# Altium project 3DMouse.PrjPcb
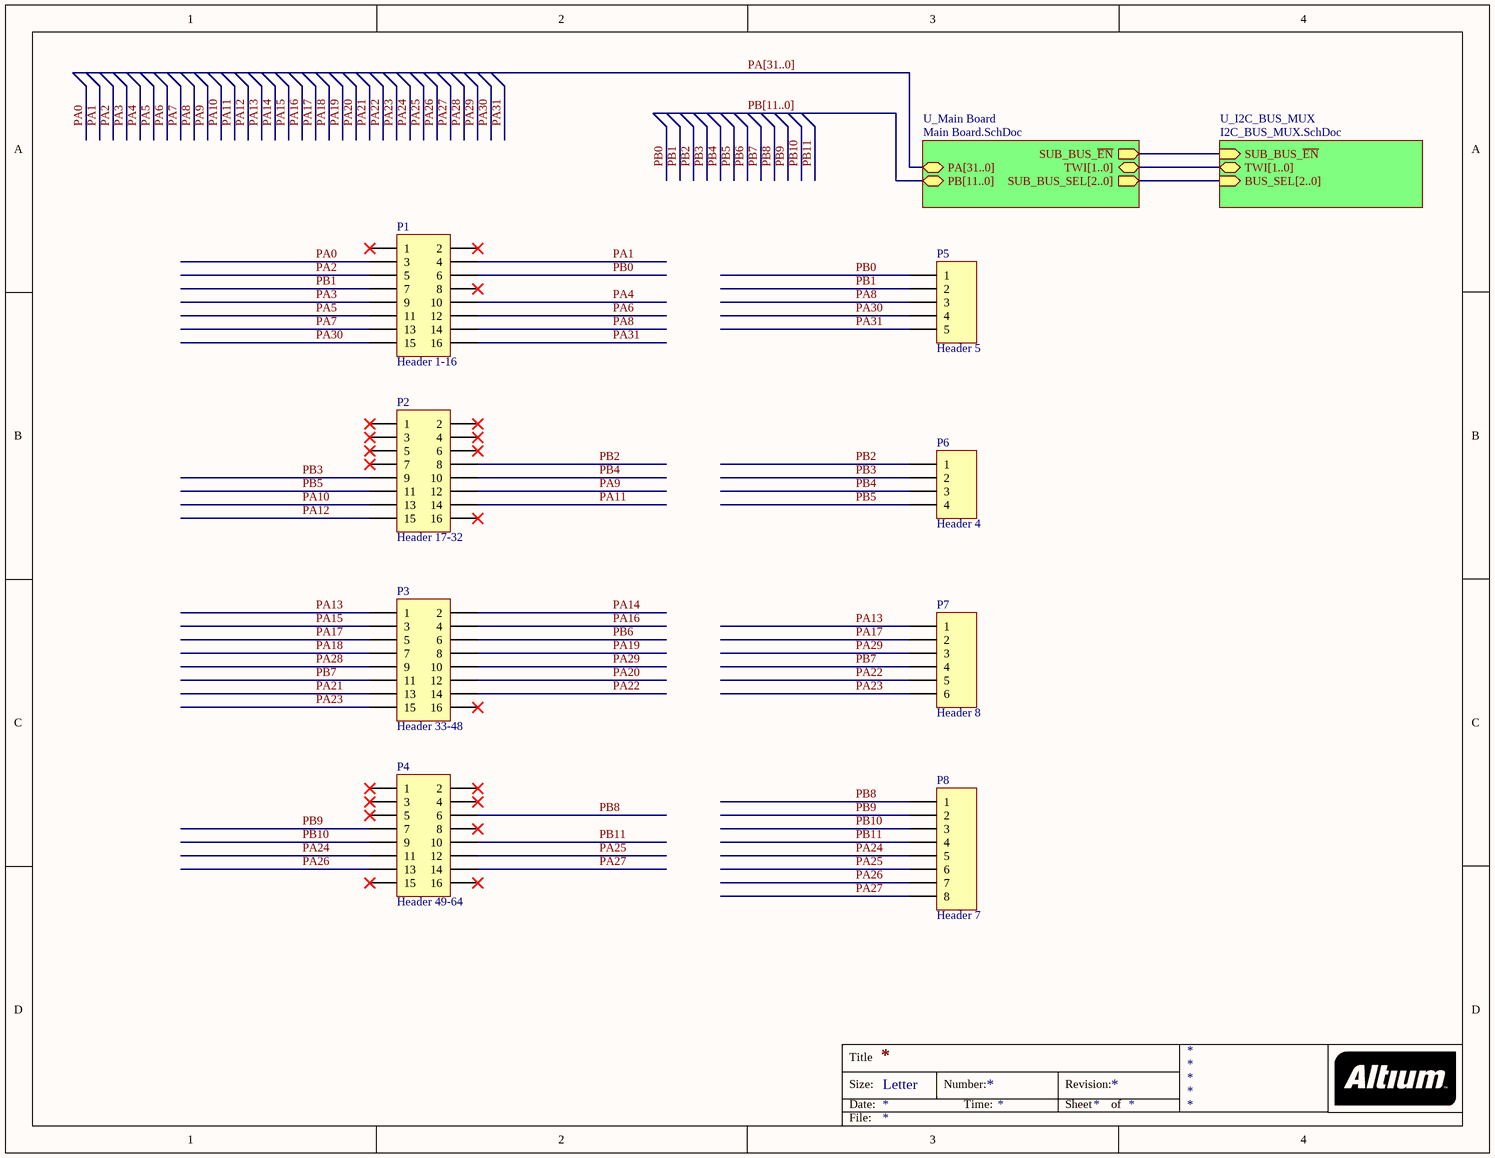
[diagram p0: 3DMouseMainBoardAssembly.SchDoc]
4 sheets, 64 parts. Net scope: hierarchical (ports join the sheet entries above them; power ports are global).
Board files: Main Board v5 China_Commercial.PcbDoc, Main Board ECEshop.PcbDoc, PCB1.PcbDoc, Main Board.PcbDoc
Sheets:
  3DMouseMainBoardAssembly.SchDoc
    U_I2C_BUS_MUX = I2C_BUS_MUX.SchDoc
    U_Main Board = Main Board.SchDoc
      U_3 = 3.3V Power Supply.SchDoc

## Sheet 3DMouseMainBoardAssembly.SchDoc
size Letter

### Parts
P1  Header 1-16  [HDR2X8]
P2  Header 17-32  [HDR2X8]
P3  Header 33-48  [HDR2X8]
P4  Header 49-64  [HDR2X8]
P5  Header 5  [HDR1X5]
P6  Header 4  [HDR1X4]
P7  Header 8  [HDR1X6]
P8  Header 7  [HDR1X8]

### Sub-sheets
U_I2C_BUS_MUX = I2C_BUS_MUX.SchDoc: SUB_BUS_~{EN} (in), TWI[1..0] (bidir), BUS_SEL[2..0] (in)
U_Main Board = Main Board.SchDoc: TWI[1..0] (bidir), SUB_BUS_~{EN} (out), SUB_BUS_SEL[2..0] (out), PA[31..0] (bidir), PB[11..0] (bidir)

### Nets
PA0: P1.3  [project net JTAG_TDI]
PA1: P1.4  [project net JTAG_TDO]
PA2: P1.5  [project net JTAG_TMS]
PA3: P1.9
PA4: P1.10 ; sheet U_I2C_BUS_MUX/SUB_BUS_~{EN}, sheet U_Main Board/SUB_BUS_~{EN}
PA5: P1.11  [project net BUS_SEL0]
PA6: P1.12  [project net BUS_SEL1]
PA7: P1.13  [project net BUS_SEL2]
PA8: P1.14 P5.3  [project net GPIO8]
PA9: P2.12
PA10: P2.13
PA11: P2.14
PA12: P2.15
PA13: P3.1 P7.1  [project net GPIO13]
PA14: P3.2  [project net MOSI]
PA15: P3.3
PA16: P3.4  [project net CSN]
PA17: P3.5 P7.2  [project net GPIO17]
PA18: P3.7
PA19: P3.8
PA20: P3.12
PA21: P3.13
PA22: P3.14 P7.5  [project net GPIO22]
PA23: P3.15 P7.6  [project net GPIO23]
PA24: P4.11 P8.5  [project net GPIO24]
PA25: P4.12 P8.6
PA26: P4.13 P8.7  [project net GPIO26]
PA27: P4.14 P8.8  [project net GPIO27]
PA28: P3.9  [project net MISO]
PA29: P3.10 P7.3  [project net GPIO29]
PA30: P1.15 P5.4  [project net GPIO30]
PA31: P1.16 P5.5  [project net GPIO31]
PB0: P1.6 P5.1  [project net GPIO32]
PB1: P1.7 P5.2  [project net GPIO33]
PB2: P2.8 P6.1  [project net GPIO34]
PB3: P2.9 P6.2  [project net GPIO35]
PB4: P2.10 P6.3  [project net GPIO36]
PB5: P2.11 P6.4  [project net GPIO37]
PB6: P3.6  [project net CE]
PB7: P3.11 P7.4  [project net GPIO39]
PB8: P4.6 P8.1  [project net GPIO40]
PB9: P4.7 P8.2  [project net GPIO41]
PB10: P4.9 P8.3  [project net GPIO42]
PB11: P4.10 P8.4  [project net GPIO43]

Not connected (* = marked no-connect by the designer): P1 1* 2* 8*; P2 1* 2* 3* 4* 5* 6* 7* 16*; P3 16*; P4 1* 2* 3* 4* 5* 8* 15* 16*

### Buses and harness runs
bus PA[31..0] = sheet U_Main Board/PA[31..0]
bus PB[11..0] = sheet U_Main Board/PB[11..0]
bus sheet U_I2C_BUS_MUX/BUS_SEL[2..0] = sheet U_Main Board/SUB_BUS_SEL[2..0]
bus sheet U_I2C_BUS_MUX/TWI[1..0] = sheet U_Main Board/TWI[1..0]

### Notes on the sheet
- Title
- Size:
- Date:
- Letter
- Number:
- Time:
- Revision:
- Sheet
- of
- File:

### Library data of the parts
P1-P4 = Header 8X2: Header, 8-Pin, Dual row; LatestRevisionDate: 17-Jul-2002; LatestRevisionNote: Re-released for DXP Platform.; Publisher: Altium Limited
P5 = Header 5: Header, 5-Pin; LatestRevisionDate: 17-Jul-2002; LatestRevisionNote: Re-released for DXP Platform.; Publisher: Altium Limited
P6 = Header 4: Header, 4-Pin; LatestRevisionDate: 17-Jul-2002; LatestRevisionNote: Re-released for DXP Platform.; Publisher: Altium Limited
P7 = Header 6: Header, 6-Pin; LatestRevisionDate: 17-Jul-2002; LatestRevisionNote: Re-released for DXP Platform.; Publisher: Altium Limited
P8 = Header 8: Header, 8-Pin; LatestRevisionDate: 17-Jul-2002; LatestRevisionNote: Re-released for DXP Platform.; Publisher: Altium Limited

## Sheet I2C_BUS_MUX.SchDoc
size Letter
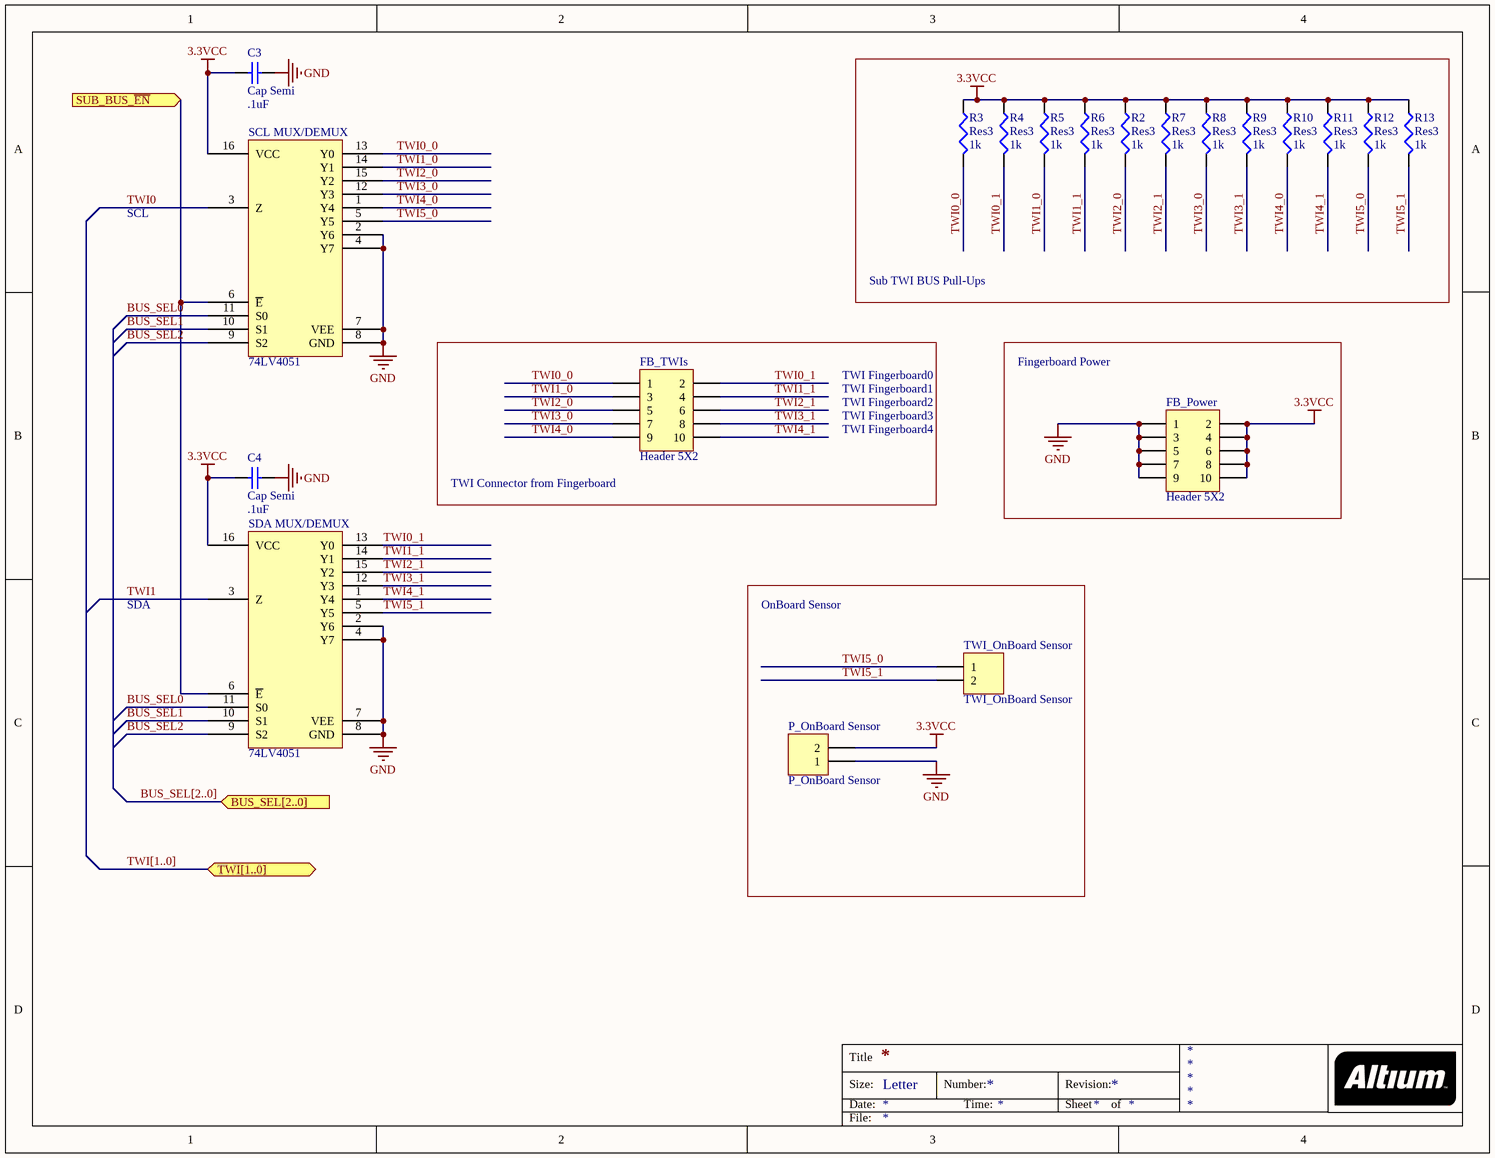
[diagram p1: I2C_BUS_MUX.SchDoc]

### Parts
C3  Cap Semi  value .1uF  [CAPC2012N]
C4  Cap Semi  value .1uF  [CAPC2012N]
FB_Power  Header 5X2  [HDR2X5]
FB_TWIs  Header 5X2  [HDR2X5]
P_OnBoard_Sensor  P_OnBoard Sensor  [HDR1X2]
R2  Res3  value 1k  [RESC2012N]
R3  Res3  value 1k  [RESC2012N]
R4  Res3  value 1k  [RESC2012N]
R5  Res3  value 1k  [RESC2012N]
R6  Res3  value 1k  [RESC2012N]
R7  Res3  value 1k  [RESC2012N]
R8  Res3  value 1k  [RESC2012N]
R9  Res3  value 1k  [RESC2012N]
R10  Res3  value 1k  [RESC2012N]
R11  Res3  value 1k  [RESC2012N]
R12  Res3  value 1k  [RESC2012N]
R13  Res3  value 1k  [RESC2012N]
SCL_MUX/DEMUX  74LV4051  [SOIC127P600-16N]
SDA_MUX/DEMUX  74LV4051  [SOIC127P600-16N]
TWI_OnBoard_Sensor  TWI_OnBoard Sensor  [HDR1X2]

### Blocks framed on the sheet
Sub TWI BUS Pull-Ups: R2-R13
Fingerboard Power: FB_Power
OnBoard Sensor: P_OnBoard_Sensor TWI_OnBoard_Sensor

### Ports
BUS_SEL[2..0] (in), SUB_BUS_~{EN} (in), TWI[1..0] (bidir)

### Nets
3.3VCC: C3.2 C4.2 FB_Power.2 FB_Power.4 FB_Power.6 FB_Power.8 FB_Power.10 P_OnBoard_Sensor.2 R2.1 R3.1 R4.1 R5.1 R6.1 R7.1 R8.1 R9.1 R10.1 R11.1 R12.1 R13.1 SCL_MUX/DEMUX.16(VCC) SDA_MUX/DEMUX.16(VCC)
GND: C3.1 C4.1 FB_Power.1 FB_Power.3 FB_Power.5 FB_Power.7 FB_Power.9 P_OnBoard_Sensor.1 SCL_MUX/DEMUX.2(Y6) SCL_MUX/DEMUX.4(Y7) SCL_MUX/DEMUX.7(VEE) SCL_MUX/DEMUX.8(GND) SDA_MUX/DEMUX.2(Y6) SDA_MUX/DEMUX.4(Y7) SDA_MUX/DEMUX.7(VEE) SDA_MUX/DEMUX.8(GND)
BUS_SEL0: SCL_MUX/DEMUX.11(S0) SDA_MUX/DEMUX.11(S0)
BUS_SEL1: SCL_MUX/DEMUX.10(S1) SDA_MUX/DEMUX.10(S1)
BUS_SEL2: SCL_MUX/DEMUX.9(S2) SDA_MUX/DEMUX.9(S2)
PA4: SCL_MUX/DEMUX.6(~{E}) SDA_MUX/DEMUX.6(~{E}) ; port SUB_BUS_~{EN}
TWI0: SCL_MUX/DEMUX.3(Z)  [project net PA9]
TWI0_0: FB_TWIs.1 R3.2 SCL_MUX/DEMUX.13(Y0)
TWI0_1: FB_TWIs.2 R4.2 SDA_MUX/DEMUX.13(Y0)
TWI1: SDA_MUX/DEMUX.3(Z)  [project net PA10]
TWI1_0: FB_TWIs.3 R5.2 SCL_MUX/DEMUX.14(Y1)
TWI1_1: FB_TWIs.4 R6.2 SDA_MUX/DEMUX.14(Y1)
TWI2_0: FB_TWIs.5 R2.2 SCL_MUX/DEMUX.15(Y2)
TWI2_1: FB_TWIs.6 R7.2 SDA_MUX/DEMUX.15(Y2)
TWI3_0: FB_TWIs.7 R8.2 SCL_MUX/DEMUX.12(Y3)
TWI3_1: FB_TWIs.8 R9.2 SDA_MUX/DEMUX.12(Y3)
TWI4_0: FB_TWIs.9 R10.2 SCL_MUX/DEMUX.1(Y4)
TWI4_1: FB_TWIs.10 R11.2 SDA_MUX/DEMUX.1(Y4)
TWI5_0: R12.2 SCL_MUX/DEMUX.5(Y5) TWI_OnBoard_Sensor.1
TWI5_1: R13.2 SDA_MUX/DEMUX.5(Y5) TWI_OnBoard_Sensor.2

### Buses and harness runs
bus BUS_SEL[2..0] = port BUS_SEL[2..0]
bus TWI[1..0] = port TWI[1..0]

### Notes on the sheet
- SCL
- TWI Fingerboard0
- TWI Fingerboard1
- TWI Fingerboard2
- TWI Fingerboard3
- TWI Fingerboard4
- (near FB_TWIs) TWI Connector from Fingerboard
- SDA
- Title
- Size:
- Date:
- Letter
- Number:
- Time:
- Revision:
- Sheet
- of
- File:

### Library data of the parts
C3 C4 = Cap Semi: Capacitor (Semiconductor SIM Model); Published: 8-Jun-2000; LatestRevisionDate: 29-May-2009; LatestRevisionNote: IPC-7351 Footprint Added.; PackageReference: C1206; Publisher: Altium Limited; PackageDescription: Chip Capacitor
FB_Power FB_TWIs = Header 5X2: Header, 5-Pin, Dual row; LatestRevisionDate: 17-Jul-2002; LatestRevisionNote: Re-released for DXP Platform.; Publisher: Altium Limited
P_OnBoard_Sensor TWI_OnBoard_Sensor = Header 2: Header, 2-Pin; LatestRevisionDate: 17-Jul-2002; LatestRevisionNote: Re-released for DXP Platform.; Publisher: Altium Limited
R2-R13 = Res3: Resistor; Published: 8-Jun-2000; LatestRevisionDate: 29-May-2009; LatestRevisionNote: IPC-7351 Footprint Added.; PackageReference: J1-0603; Publisher: Altium Limited; PackageDescription: Chip Resistor

## Sheet Main Board.SchDoc: Main Board
size Letter
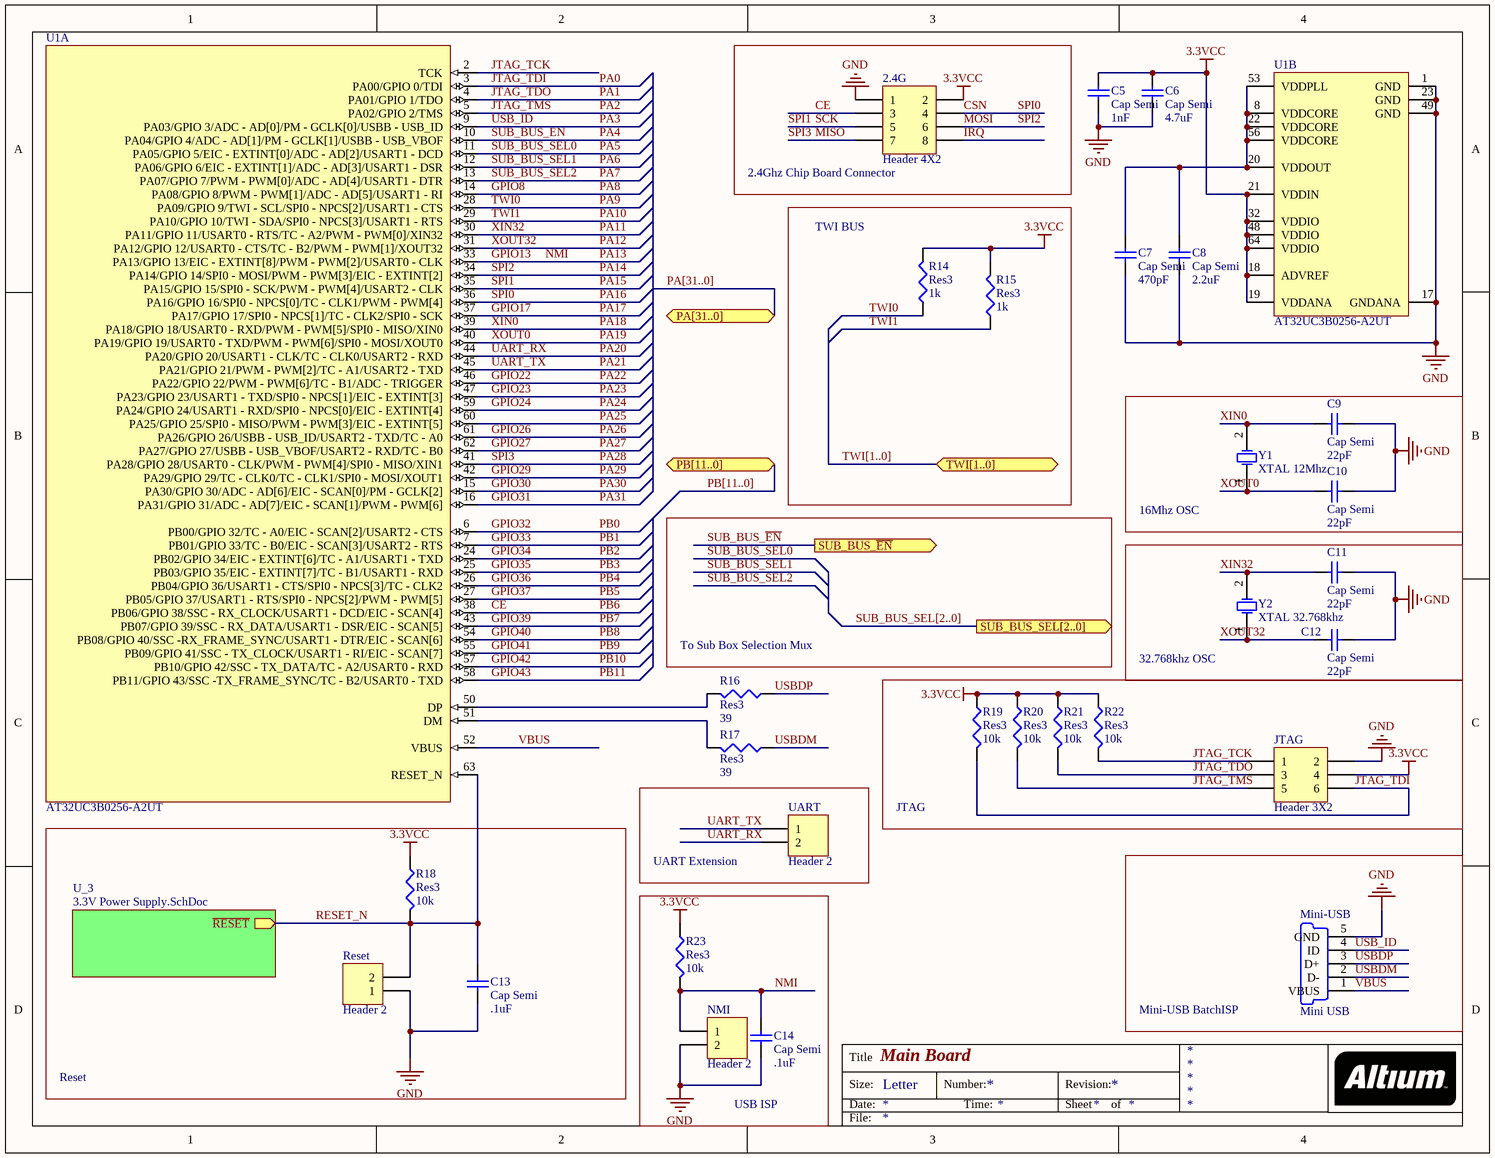
[diagram p2: Main Board.SchDoc]

### Parts
2.4G  Header 4X2  [HDR2X4]
C5  Cap Semi  value 1nF  [CAPC2012N]
C6  Cap Semi  value 4.7uF  [CAPC2012N]
C7  Cap Semi  value 470pF  [CAPC2012N]
C8  Cap Semi  value 2.2uF  [CAPC2012N]
C9  Cap Semi  value 22pF  [CAPC2012N]
C10  Cap Semi  value 22pF  [CAPC2012N]
C11  Cap Semi  value 22pF  [CAPC2012N]
C12  Cap Semi  value 22pF  [CAPC2012N]
C13  Cap Semi  value .1uF  [CAPC2012N]
C14  Cap Semi  value .1uF  [CAPC2012N]
JTAG  Header 3X2  [HDR2X3]
Mini-USB  Mini USB  [MINI USB]
NMI  Header 2  [HDR1X2]
R14  Res3  value 1k  [RESC2012N]
R15  Res3  value 1k  [RESC2012N]
R16  Res3  value 39  [RESC2012N]
R17  Res3  value 39  [RESC2012N]
R18  Res3  value 10k  [RESC2012N]
R19  Res3  value 10k  [RESC2012N]
R20  Res3  value 10k  [RESC2012N]
R21  Res3  value 10k  [RESC2012N]
R22  Res3  value 10k  [RESC2012N]
R23  Res3  value 10k  [RESC2012N]
Reset  Header 2  [HDR1X2]
U1  AT32UC3B0256-A2UT  [TQFP64_N - ECESHOP]  (parts A,B of 2)
UART  Header 2  [HDR1X2]
Y1  XTAL 12Mhz  [HC-49U - Through Hole]
Y2  XTAL 32.768khz  [XTAL32.768]

### Blocks framed on the sheet
2.4Ghz Chip Board Connector: 2.4G
TWI BUS: R14 R15
16Mhz OSC: C9 C10 Y1
32.768khz OSC: C11 C12 Y2
JTAG: JTAG R19-R22
UART Extension: UART
Reset: C13 R18 Reset
Mini-USB BatchISP: Mini-USB
USB ISP: C14 NMI R23

### Sub-sheets
U_3 = 3.3V Power Supply.SchDoc: ~{RESET} (out)

### Ports
PA[31..0] (bidir), PB[11..0] (bidir), SUB_BUS_SEL[2..0] (out), SUB_BUS_~{EN} (out), TWI[1..0] (bidir)

### Nets
3.3VCC: 2.4G.2 C5.2 C6.2 JTAG.4 R14.2 R15.2 R18.1 R19.1 R20.1 R21.1 R22.1 R23.1 U1.18(ADVREF) U1.19(VDDANA) U1.21(VDDIN) U1.32(VDDIO) U1.48(VDDIO) U1.64(VDDIO)
GND: 2.4G.1 C5.1 C6.1 C7.1 C8.1 C9.1 C10.1 C11.1 C12.1 C13.2 C14.2 JTAG.2 Mini-USB.5(GND) NMI.2 Reset.1 U1.1(GND) U1.17(GNDANA) U1.23(GND) U1.49(GND)
CE: 2.4G.3 U1.38(PB06/GPIO_38/SSC_-_RX_CLOCK/USART1_-_DCD/EIC_-_SCAN[4])  [also labelled PB6]
CSN: 2.4G.4 U1.36(PA16/GPIO_16/SPI0_-_NPCS[0]/TC_-_CLK1/PWM_-_PWM[4])  [also labelled PA16, SPI0]
GPIO8: U1.14(PA08/GPIO_8/PWM_-_PWM[1]/ADC_-_AD[5]/USART1_-_RI)  [also labelled PA8]
GPIO13: C14.1 NMI.1 R23.2 U1.33(PA13/GPIO_13/EIC_-_EXTINT[8]/PWM_-_PWM[2]/USART0_-_CLK)  [also labelled NMI, PA13]
GPIO17: U1.37(PA17/GPIO_17/SPI0_-_NPCS[1]/TC_-_CLK2/SPI0_-_SCK)  [also labelled PA17]
GPIO22: U1.46(PA22/GPIO_22/PWM_-_PWM[6]/TC_-_B1/ADC_-_TRIGGER)  [also labelled PA22]
GPIO23: U1.47(PA23/GPIO_23/USART1_-_TXD/SPI0_-_NPCS[1]/EIC_-_EXTINT[3])  [also labelled PA23]
GPIO24: U1.59(PA24/GPIO_24/USART1_-_RXD/SPI0_-_NPCS[0]/EIC_-_EXTINT[4])  [also labelled PA24]
GPIO26: U1.61(PA26/GPIO_26/USBB_-_USB_ID/USART2_-_TXD/TC_-_A0)  [also labelled PA26]
GPIO27: U1.62(PA27/GPIO_27/USBB_-_USB_VBOF/USART2_-_RXD/TC_-_B0)  [also labelled PA27]
GPIO29: U1.42(PA29/GPIO_29/TC_-_CLK0/TC_-_CLK1/SPI0_-_MOSI/XOUT1)  [also labelled PA29]
GPIO30: U1.15(PA30/GPIO_30/ADC_-_AD[6]/EIC_-_SCAN[0]/PM_-_GCLK[2])  [also labelled PA30]
GPIO31: U1.16(PA31/GPIO_31/ADC_-_AD[7]/EIC_-_SCAN[1]/PWM_-_PWM[6])  [also labelled PA31]
GPIO32: U1.6(PB00/GPIO_32/TC_-_A0/EIC_-_SCAN[2]/USART2_-_CTS)  [also labelled PB0]
GPIO33: U1.7(PB01/GPIO_33/TC_-_B0/EIC_-_SCAN[3]/USART2_-_RTS)  [also labelled PB1]
GPIO34: U1.24(PB02/GPIO_34/EIC_-_EXTINT[6]/TC_-_A1/USART1_-_TXD)  [also labelled PB2]
GPIO35: U1.25(PB03/GPIO_35/EIC_-_EXTINT[7]/TC_-_B1/USART1_-_RXD)  [also labelled PB3]
GPIO36: U1.26(PB04/GPIO_36/USART1_-_CTS/SPI0_-_NPCS[3]/TC_-_CLK2)  [also labelled PB4]
GPIO37: U1.27(PB05/GPIO_37/USART1_-_RTS/SPI0_-_NPCS[2]/PWM_-_PWM[5])  [also labelled PB5]
GPIO39: U1.43(PB07/GPIO_39/SSC_-_RX_DATA/USART1_-_DSR/EIC_-_SCAN[5])  [also labelled PB7]
GPIO40: U1.54(PB08/GPIO_40/SSC_-RX_FRAME_SYNC/USART1_-_DTR/EIC_-_SCAN[6])  [also labelled PB8]
GPIO41: U1.55(PB09/GPIO_41/SSC_-_TX_CLOCK/USART1_-_RI/EIC_-_SCAN[7])  [also labelled PB9]
GPIO42: U1.57(PB10/GPIO_42/SSC_-_TX_DATA/TC_-_A2/USART0_-_RXD)  [also labelled PB10]
GPIO43: U1.58(PB11/GPIO_43/SSC_-TX_FRAME_SYNC/TC_-_B2/USART0_-_TXD)  [also labelled PB11]
IRQ: 2.4G.8
JTAG_TCK: JTAG.1 R22.2 U1.2(TCK)
JTAG_TDI: JTAG.6 R19.2 U1.3(PA00/GPIO_0/TDI)  [also labelled PA0]
JTAG_TDO: JTAG.3 R21.2 U1.4(PA01/GPIO_1/TDO)  [also labelled PA1]
JTAG_TMS: JTAG.5 R20.2 U1.5(PA02/GPIO_2/TMS)  [also labelled PA2]
MISO: 2.4G.7 U1.41(PA28/GPIO_28/USART0_-_CLK/PWM_-_PWM[4]/SPI0_-_MISO/XIN1)  [also labelled PA28, SPI3]
MOSI: 2.4G.6 U1.34(PA14/GPIO_14/SPI0_-_MOSI/PWM_-_PWM[3]/EIC_-_EXTINT[2])  [also labelled PA14, SPI2]
PA3: Mini-USB.4(ID) U1.9(PA03/GPIO_3/ADC_-_AD[0]/PM_-_GCLK[0]/USBB_-_USB_ID)  [also labelled USB_ID]
PA4: U1.10(PA04/GPIO_4/ADC_-_AD[1]/PM_-_GCLK[1]/USBB_-_USB_VBOF) ; port SUB_BUS_~{EN}  [also labelled SUB_BUS_~{EN}]
PA5: U1.11(PA05/GPIO_5/EIC_-_EXTINT[0]/ADC_-_AD[2]/USART1_-_DCD)  [also labelled SUB_BUS_SEL0]  [project net BUS_SEL0]
PA6: U1.12(PA06/GPIO_6/EIC_-_EXTINT[1]/ADC_-_AD[3]/USART1_-_DSR)  [also labelled SUB_BUS_SEL1]  [project net BUS_SEL1]
PA7: U1.13(PA07/GPIO_7/PWM_-_PWM[0]/ADC_-_AD[4]/USART1_-_DTR)  [also labelled SUB_BUS_SEL2]  [project net BUS_SEL2]
PA9: R14.1 U1.28(PA09/GPIO_9/TWI_-_SCL/SPI0_-_NPCS[2]/USART1_-_CTS)  [also labelled TWI0]
PA10: R15.1 U1.29(PA10/GPIO_10/TWI_-_SDA/SPI0_-_NPCS[3]/USART1_-_RTS)  [also labelled TWI1]
PA11: C11.2 U1.30(PA11/GPIO_11/USART0_-_RTS/TC_-_A2/PWM_-_PWM[0]/XIN32) Y2.2(OSC2)  [also labelled XIN32]
PA12: C12.2 U1.31(PA12/GPIO_12/USART0_-_CTS/TC_-_B2/PWM_-_PWM[1]/XOUT32) Y2.1(OSC1)  [also labelled XOUT32]
PA15: 2.4G.5 U1.35(PA15/GPIO_15/SPI0_-_SCK/PWM_-_PWM[4]/USART2_-_CLK)  [also labelled SCK, SPI1]
PA18: C9.2 U1.39(PA18/GPIO_18/USART0_-_RXD/PWM_-_PWM[5]/SPI0_-_MISO/XIN0) Y1.2(OSC2)  [also labelled XIN0]
PA19: C10.2 U1.40(PA19/GPIO_19/USART0_-_TXD/PWM_-_PWM[6]/SPI0_-_MOSI/XOUT0) Y1.1(OSC1)  [also labelled XOUT0]
PA20: U1.44(PA20/GPIO_20/USART1_-_CLK/TC_-_CLK0/USART2_-_RXD) UART.2  [also labelled UART_RX]
PA21: U1.45(PA21/GPIO_21/PWM_-_PWM[2]/TC_-_A1/USART2_-_TXD) UART.1  [also labelled UART_TX]
PA25: U1.60(PA25/GPIO_25/SPI0_-_MISO/PWM_-_PWM[3]/EIC_-_EXTINT[5])
RESET_N: C13.1 R18.2 Reset.2 U1.63(RESET_N) ; sheet U_3/~{RESET}
USBDM: Mini-USB.2(D-) R17.1
USBDP: Mini-USB.3(D+) R16.1
VBUS: Mini-USB.1(VBUS) U1.52(VBUS)
NetC7_2: C7.2 C8.2 U1.8(VDDCORE) U1.20(VDDOUT) U1.22(VDDCORE) U1.53(VDDPLL) U1.56(VDDCORE)
NetR16_2: R16.2 U1.50(DP)
NetR17_2: R17.2 U1.51(DM)

### Buses and harness runs
bus PA[31..0] = port PA[31..0]
bus PB[11..0] = port PB[11..0]
bus SUB_BUS_SEL[2..0] = port SUB_BUS_SEL[2..0]
bus TWI[1..0] = port TWI[1..0]

### Notes on the sheet
- (near R16) To Sub Box Selection Mux
- Title
- Size:
- Date:
- Letter
- Number:
- Time:
- Revision:
- Sheet
- of
- File:

### Library data of the parts
2.4G = Header 4X2: Header, 4-Pin, Dual row; LatestRevisionDate: 17-Jul-2002; LatestRevisionNote: Re-released for DXP Platform.; Publisher: Altium Limited
C5-C14 = Cap Semi: Capacitor (Semiconductor SIM Model); Published: 8-Jun-2000; LatestRevisionDate: 29-May-2009; LatestRevisionNote: IPC-7351 Footprint Added.; PackageReference: C1206; Publisher: Altium Limited; PackageDescription: Chip Capacitor
JTAG = Header 3X2: Header, 3-Pin, Dual row; LatestRevisionDate: 17-Jul-2002; LatestRevisionNote: Re-released for DXP Platform.; Publisher: Altium Limited
NMI Reset UART = Header 2: Header, 2-Pin; LatestRevisionDate: 17-Jul-2002; LatestRevisionNote: Re-released for DXP Platform.; Publisher: Altium Limited
R14-R23 = Res3: Resistor; Published: 8-Jun-2000; LatestRevisionDate: 29-May-2009; LatestRevisionNote: IPC-7351 Footprint Added.; PackageReference: J1-0603; Publisher: Altium Limited; PackageDescription: Chip Resistor
U1 = AT32UC3B0256-A2UT: 32-bit AVR UC3 B Series Microcontroller, 256KB Flash, 32KB SRAM, 44 GPIO pins, Industrial Grade, 64-Pin TQFP, Tray; Published: 1-Apr-2010; DatasheetVersion: revH, Feb-2010; PackageVersion: 2010; PackageReference: TQFP64; Publisher: Altium Limited; PackageDescription: 64-Pin Thin Quad Flat Pack, 10 x 10 x 1.0 mm Body, 0.5 mm Pitch; Supplier 1: Digi-Key; Supplier Part Number 1: AT32UC3B0256-A2UT-ND; Supplier 2: Farnell; Supplier Part Number 2: 1715453; Supplier 3: Mouser; Supplier Part Number 3: 556-AT32UC3B0256A2UT; Code_JEDEC: MS-026; ComponentLink1Description: Manufacturer Link; ComponentLink1URL: http://www.atmel.com/products/avr/default.asp?; ComponentLink2Description: AT32UC3B Datasheet; ComponentLink2URL: http://www.atmel.com/dyn/resources/prod_documents/doc32059.pdf; ComponentLink3Description: AT32UC3B Summary; ComponentLink3URL: http://www.atmel.com/dyn/resources/prod_documents/32059S.pdf; ComponentLink4Description: Atmel.com Home; ComponentLink4URL: http://www.atmel.com
Y1 Y2 = XTAL: Crystal Oscillator; Published: 8-Jun-2000; LatestRevisionDate: 17-Jul-2002; LatestRevisionNote: Re-released for DXP Platform.; PackageReference: R38; Publisher: Altium Limited; PackageDescription: Crystal, Thru-Hole; 2 Leads; Body 3.1 x 8.2 mm (Dia.xH)
Mini-USB = Mini USB: Supplier 1: Digi-Key; Supplier Part Number 1: A31727CT-ND

## Sheet 3.3V Power Supply.SchDoc: 3.3V Power Supply
size Letter
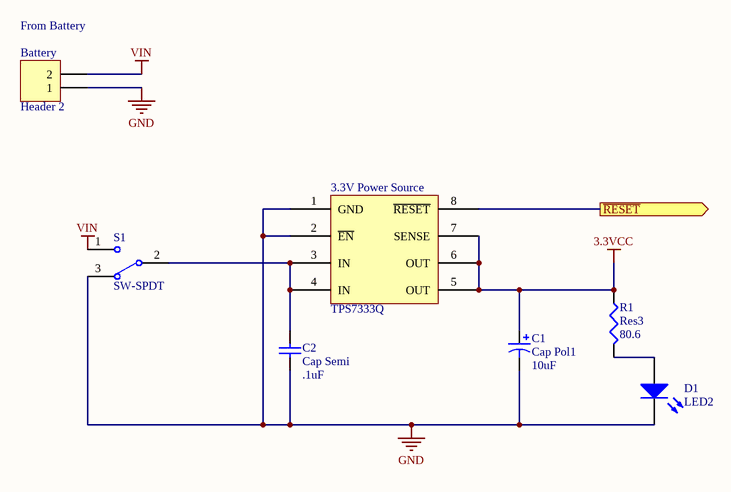
[diagram p3: 3.3V Power Supply.SchDoc]

### Parts
3.3V_Power_Source  TPS7333Q  [SOIC127P600-8BN]
Battery  Header 2  [HDR1X2]
C1  Cap Pol1  value 10uF  [TC7343-2917]
C2  Cap Semi  value .1uF  [CAPC2012N]
D1  LED2  [RESC3216N]
R1  Res3  value 80.6  [RESC2012N]
S1  SW-SPDT  [563-1102-1-ND]

### Ports
~{RESET} (out)

### Nets
3.3VCC: 3.3V_Power_Source.5(OUT) 3.3V_Power_Source.6(OUT) 3.3V_Power_Source.7(SENSE) C1.1 R1.1
GND: 3.3V_Power_Source.1(GND) 3.3V_Power_Source.2(~{EN}) Battery.1 C1.2 C2.1 D1.2(K) S1.3
VIN: Battery.2 S1.1
RESET_N: 3.3V_Power_Source.8(~{RESET}) ; port ~{RESET}
Net3.3V_Power_Source_3: 3.3V_Power_Source.3(IN) 3.3V_Power_Source.4(IN) C2.2 S1.2
NetD1_1: D1.1(A) R1.2

### Notes on the sheet
- (near Battery) From Battery
- Title
- Size:
- Date:
- Letter
- Number:
- Time:
- Revision:
- Sheet
- of
- File:

### Library data of the parts
Battery = Header 2: Header, 2-Pin; LatestRevisionDate: 17-Jul-2002; LatestRevisionNote: Re-released for DXP Platform.; Publisher: Altium Limited
C1 = Cap Pol1: Polarized Capacitor (Radial); Published: 8-Jun-2000; LatestRevisionDate: 17-Jul-2002; LatestRevisionNote: Re-released for DXP Platform.; PackageReference: RB7.6-15; Publisher: Altium Limited; PackageDescription: Polarized Capacitor (Radial); 2 Leads
C2 = Cap Semi: Capacitor (Semiconductor SIM Model); Published: 8-Jun-2000; LatestRevisionDate: 29-May-2009; LatestRevisionNote: IPC-7351 Footprint Added.; PackageReference: C1206; Publisher: Altium Limited; PackageDescription: Chip Capacitor
D1 = LED2: Typical RED, GREEN, YELLOW, AMBER GaAs LED; Published: 8-Jun-2000; LatestRevisionDate: 17-Jul-2002; LatestRevisionNote: Re-released for DXP Platform.; PackageVersion: Feb-2002; PackageReference: 3.2X1.6X1.1; Publisher: Altium Limited; PackageDescription: SM LED; 2 Flat Leads
R1 = Res3: Resistor; Published: 8-Jun-2000; LatestRevisionDate: 29-May-2009; LatestRevisionNote: IPC-7351 Footprint Added.; PackageReference: J1-0603; Publisher: Altium Limited; PackageDescription: Chip Resistor
S1 = SW-SPDT: SPDT Subminiature Toggle Switch, Right Angle Mounting, Vertical Actuation; Published: 24-Mar-1999; LatestRevisionDate: 17-Dec-2003; LatestRevisionNote: Schematic revised, PCB Footprint replaced.; DatasheetVersion: 05-Dec-2000; PackageReference: TL36WW15050; Publisher: Altium Limited; PackageDescription: Switch; 4 Leads; ComponentLink1Description: Manufacturer Link; ComponentLink1URL: http://www.apem.com

## Nets that join several sheets
3.3VCC: I2C_BUS_MUX (22 pins), Main Board (18 pins), 3.3V Power Supply (5 pins)
GND: I2C_BUS_MUX (16 pins), Main Board (19 pins), 3.3V Power Supply (7 pins)
BUS_SEL0: 3DMouseMainBoardAssembly (P1.11), I2C_BUS_MUX (SCL_MUX/DEMUX.11 SDA_MUX/DEMUX.11), Main Board (U1.11)
BUS_SEL1: 3DMouseMainBoardAssembly (P1.12), I2C_BUS_MUX (SCL_MUX/DEMUX.10 SDA_MUX/DEMUX.10), Main Board (U1.12)
BUS_SEL2: 3DMouseMainBoardAssembly (P1.13), I2C_BUS_MUX (SCL_MUX/DEMUX.9 SDA_MUX/DEMUX.9), Main Board (U1.13)
CE: 3DMouseMainBoardAssembly (P3.6), Main Board (2.4G.3 U1.38)
CSN: 3DMouseMainBoardAssembly (P3.4), Main Board (2.4G.4 U1.36)
GPIO8: 3DMouseMainBoardAssembly (P1.14 P5.3), Main Board (U1.14)
GPIO13: 3DMouseMainBoardAssembly (P3.1 P7.1), Main Board (C14.1 NMI.1 R23.2 U1.33)
GPIO17: 3DMouseMainBoardAssembly (P3.5 P7.2), Main Board (U1.37)
GPIO22: 3DMouseMainBoardAssembly (P3.14 P7.5), Main Board (U1.46)
GPIO23: 3DMouseMainBoardAssembly (P3.15 P7.6), Main Board (U1.47)
GPIO24: 3DMouseMainBoardAssembly (P4.11 P8.5), Main Board (U1.59)
GPIO26: 3DMouseMainBoardAssembly (P4.13 P8.7), Main Board (U1.61)
GPIO27: 3DMouseMainBoardAssembly (P4.14 P8.8), Main Board (U1.62)
GPIO29: 3DMouseMainBoardAssembly (P3.10 P7.3), Main Board (U1.42)
GPIO30: 3DMouseMainBoardAssembly (P1.15 P5.4), Main Board (U1.15)
GPIO31: 3DMouseMainBoardAssembly (P1.16 P5.5), Main Board (U1.16)
GPIO32: 3DMouseMainBoardAssembly (P1.6 P5.1), Main Board (U1.6)
GPIO33: 3DMouseMainBoardAssembly (P1.7 P5.2), Main Board (U1.7)
GPIO34: 3DMouseMainBoardAssembly (P2.8 P6.1), Main Board (U1.24)
GPIO35: 3DMouseMainBoardAssembly (P2.9 P6.2), Main Board (U1.25)
GPIO36: 3DMouseMainBoardAssembly (P2.10 P6.3), Main Board (U1.26)
GPIO37: 3DMouseMainBoardAssembly (P2.11 P6.4), Main Board (U1.27)
GPIO39: 3DMouseMainBoardAssembly (P3.11 P7.4), Main Board (U1.43)
GPIO40: 3DMouseMainBoardAssembly (P4.6 P8.1), Main Board (U1.54)
GPIO41: 3DMouseMainBoardAssembly (P4.7 P8.2), Main Board (U1.55)
GPIO42: 3DMouseMainBoardAssembly (P4.9 P8.3), Main Board (U1.57)
GPIO43: 3DMouseMainBoardAssembly (P4.10 P8.4), Main Board (U1.58)
JTAG_TDI: 3DMouseMainBoardAssembly (P1.3), Main Board (JTAG.6 R19.2 U1.3)
JTAG_TDO: 3DMouseMainBoardAssembly (P1.4), Main Board (JTAG.3 R21.2 U1.4)
JTAG_TMS: 3DMouseMainBoardAssembly (P1.5), Main Board (JTAG.5 R20.2 U1.5)
MISO: 3DMouseMainBoardAssembly (P3.9), Main Board (2.4G.7 U1.41)
MOSI: 3DMouseMainBoardAssembly (P3.2), Main Board (2.4G.6 U1.34)
PA3: 3DMouseMainBoardAssembly (P1.9), Main Board (Mini-USB.4 U1.9)
PA4: 3DMouseMainBoardAssembly (P1.10), I2C_BUS_MUX (SCL_MUX/DEMUX.6 SDA_MUX/DEMUX.6), Main Board (U1.10)
PA9: 3DMouseMainBoardAssembly (P2.12), I2C_BUS_MUX (SCL_MUX/DEMUX.3), Main Board (R14.1 U1.28)
PA10: 3DMouseMainBoardAssembly (P2.13), I2C_BUS_MUX (SDA_MUX/DEMUX.3), Main Board (R15.1 U1.29)
PA11: 3DMouseMainBoardAssembly (P2.14), Main Board (C11.2 U1.30 Y2.2)
PA12: 3DMouseMainBoardAssembly (P2.15), Main Board (C12.2 U1.31 Y2.1)
PA15: 3DMouseMainBoardAssembly (P3.3), Main Board (2.4G.5 U1.35)
PA18: 3DMouseMainBoardAssembly (P3.7), Main Board (C9.2 U1.39 Y1.2)
PA19: 3DMouseMainBoardAssembly (P3.8), Main Board (C10.2 U1.40 Y1.1)
PA20: 3DMouseMainBoardAssembly (P3.12), Main Board (U1.44 UART.2)
PA21: 3DMouseMainBoardAssembly (P3.13), Main Board (U1.45 UART.1)
PA25: 3DMouseMainBoardAssembly (P4.12 P8.6), Main Board (U1.60)
RESET_N: Main Board (C13.1 R18.2 Reset.2 U1.63), 3.3V Power Supply (3.3V_Power_Source.8)